# Altium schematic sheet Sheet4.SchDoc
size A4
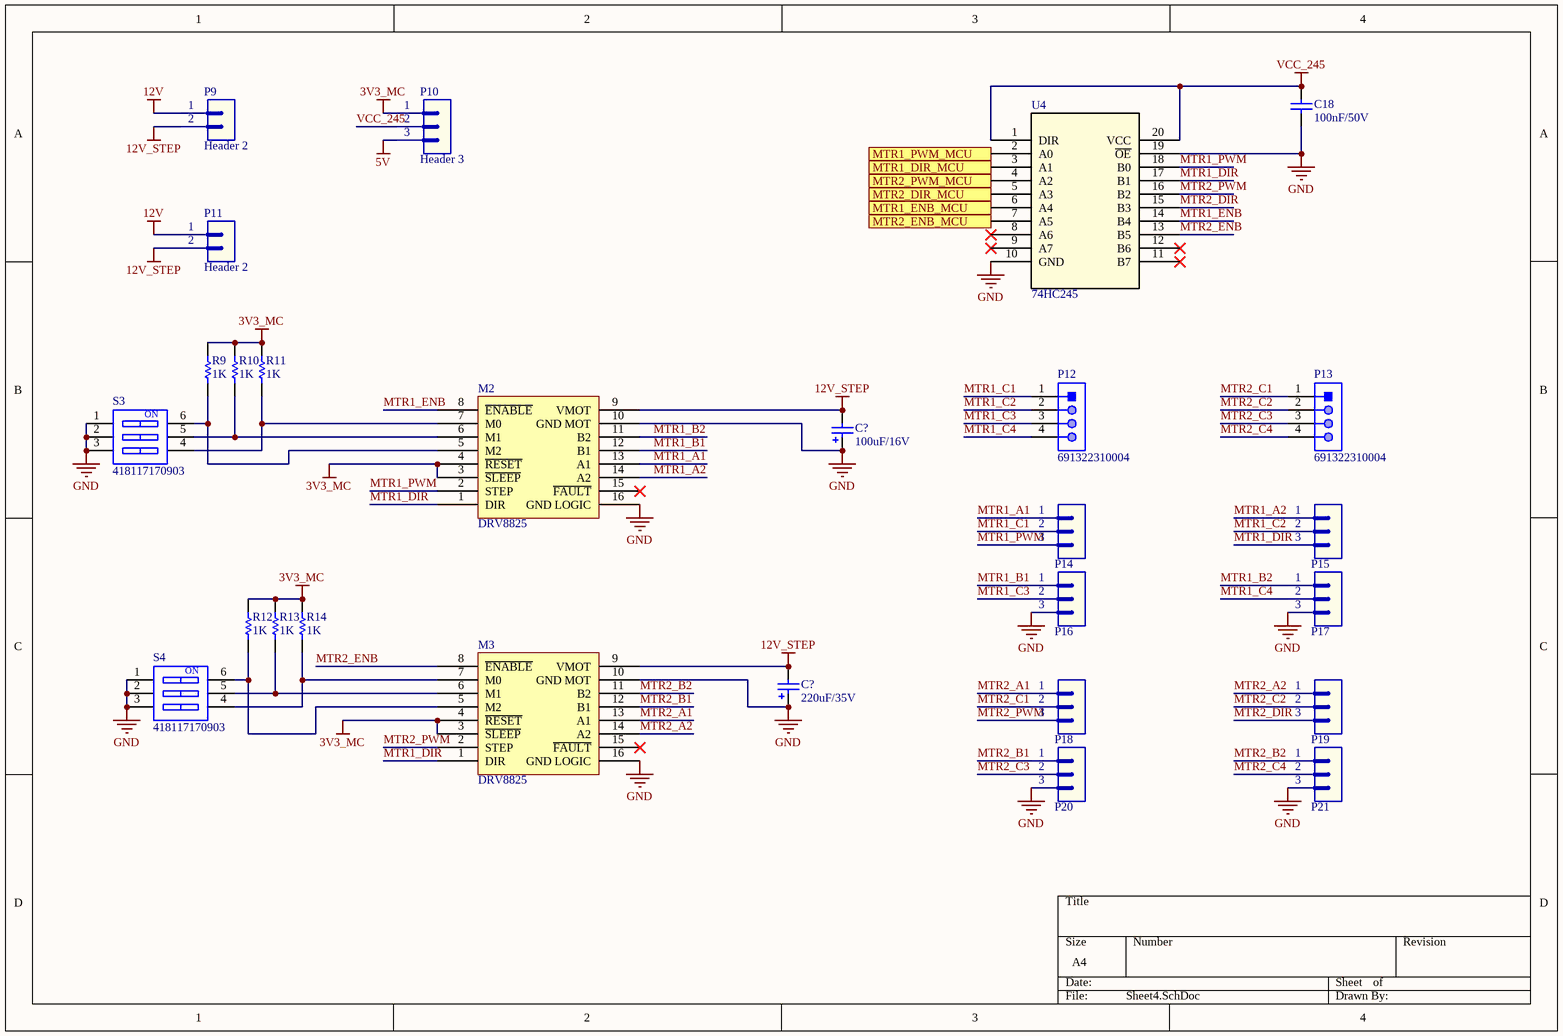
[diagram p0: Sheet4.SchDoc]

## Parts
(Parts that share a designator on the sheet are numbered #1, #2 ... from top to bottom, then left to right.)
C18  value 100nF/50V  [CAP-SM-0805]  (hidden comment: Cap-10uF-50V-0805)
C?#1  value 100uF/16V  [CAP-SM-AL-SIZE-D-D6L6]  (hidden comment: Cap-Al-100uF-16V-D6L5)
C?#2  value 220uF/35V  [CAP-SM-AL-SIZE-F-D8L10]  (hidden comment: Cap-Al-220uF-35V-D8L10)
M2  DRV8825  [DRV8825]
M3  DRV8825  [DRV8825]
P9  Header 2  [JP2]
P10  Header 3  [JP3]
P11  Header 2  [JP2]
P12  691322310004  [691322310004]
P13  691322310004  [691322310004]
P14  Header 3  [JP3]  (value not drawn)
P15  Header 3  [JP3]  (value not drawn)
P16  Header 3  [JP3]  (value not drawn)
P17  Header 3  [JP3]  (value not drawn)
P18  Header 3  [JP3]  (value not drawn)
P19  Header 3  [JP3]  (value not drawn)
P20  Header 3  [JP3]  (value not drawn)
P21  Header 3  [JP3]  (value not drawn)
R9  value 1K  [RES-SM-0805]  (hidden comment: Res-1K-0805)
R10  value 1K  [RES-SM-0805]  (hidden comment: Res-1K-0805)
R11  value 1K  [RES-SM-0805]  (hidden comment: Res-1K-0805)
R12  value 1K  [RES-SM-0805]  (hidden comment: Res-1K-0805)
R13  value 1K  [RES-SM-0805]  (hidden comment: Res-1K-0805)
R14  value 1K  [RES-SM-0805]  (hidden comment: Res-1K-0805)
S3  418117170903  [418117170903]
S4  418117170903  [418117170903]
U4  74HC245  [74HC245,625]

## Ports
MTR1_DIR_MCU (in), MTR1_ENB_MCU (in), MTR1_PWM_MCU (in), MTR2_DIR_MCU (in), MTR2_ENB_MCU (in), MTR2_PWM_MCU (in)

## Nets
3V3_MC: M2.3(~{SLEEP}) M2.4(~{RESET}) M3.3(~{SLEEP}) M3.4(~{RESET}) P10.1 R9.2 R10.2 R11.2 R12.2 R13.2 R14.2
5V: P10.3
12V: P9.1 P11.1
12V_STEP: C?#1.2 C?#2.2 M2.9(VMOT) M3.9(VMOT) P9.2 P11.2
GND: C18.1 C?#1.1 C?#2.1 M2.10(GND_MOT) M2.16(GND_LOGIC) M3.10(GND_MOT) M3.16(GND_LOGIC) P16.3 P17.3 P20.3 P21.3 S3.1 S3.2 S3.3 S4.1 S4.2 S4.3 U4.10(GND) U4.19(~{OE})
VCC_245: C18.2 P10.2 U4.1(DIR) U4.20(VCC)
MTR1_A1: M2.13(A1) P14.1
MTR1_A2: M2.14(A2) P15.1
MTR1_B1: M2.12(B1) P16.1
MTR1_B2: M2.11(B2) P17.1
MTR1_C1: P12.1 P14.2
MTR1_C2: P12.2 P15.2
MTR1_C3: P12.3 P16.2
MTR1_C4: P12.4 P17.2
MTR1_DIR: M2.1(DIR) M3.1(DIR) P15.3 U4.17(B1)
MTR1_DIR_MCU: U4.3(A1) ; port MTR1_DIR_MCU
MTR1_ENB: M2.8(~{ENABLE}) U4.14(B4)
MTR1_ENB_MCU: U4.6(A4) ; port MTR1_ENB_MCU
MTR1_PWM: M2.2(STEP) P14.3 U4.18(B0)
MTR1_PWM_MCU: U4.2(A0) ; port MTR1_PWM_MCU
MTR2_A1: M3.13(A1) P18.1
MTR2_A2: M3.14(A2) P19.1
MTR2_B1: M3.12(B1) P20.1
MTR2_B2: M3.11(B2) P21.1
MTR2_C1: P13.1 P18.2
MTR2_C2: P13.2 P19.2
MTR2_C3: P13.3 P20.2
MTR2_C4: P13.4 P21.2
MTR2_DIR: P19.3 U4.15(B3)
MTR2_DIR_MCU: U4.5(A3) ; port MTR2_DIR_MCU
MTR2_ENB: M3.8(~{ENABLE}) U4.13(B5)
MTR2_ENB_MCU: U4.7(A5) ; port MTR2_ENB_MCU
MTR2_PWM: M3.2(STEP) P18.3 U4.16(B2)
MTR2_PWM_MCU: U4.4(A2) ; port MTR2_PWM_MCU
NetM2_5: M2.5(M2) R9.1 S3.6
NetM2_6: M2.6(M1) R10.1 S3.5
NetM2_7: M2.7(M0) R11.1 S3.4
NetM3_5: M3.5(M2) R12.1 S4.6
NetM3_6: M3.6(M1) R13.1 S4.5
NetM3_7: M3.7(M0) R14.1 S4.4

Not connected (* = marked no-connect by the designer): M2 15(~{FAULT})*; M3 15(~{FAULT})*; U4 8(A6)* 9(A7)* 11(B7)* 12(B6)*

## Notes on the sheet
- (in symbol 418117170903) ON

## Library data of the parts
C18 = Cap-10uF-50V-0805: CAP CER 10UF 50V X5R 0805; Manufacturer: Yageo; Manufacturer Part Number: CC0805KKX5R9BB106; Local Supplier: thegioiic; Local Supplier Link: https://thegioiic.com/products/tu-10uf-50v-0805; Supplier 1: Digikey; Supplier 1 Link: https://www.digikey.com/product-detail/en/yageo/CC0805KKX5R9BB106/311-3499-2-ND/7164383; Supplier 1 Part Number: 311-3499-2-ND
C?#1 = Cap-Al-100uF-16V-D6L5: CAP ALUM 100UF 20% 16V SMD; Manufacturer: Nichicon; Manufacturer Part Number: UWX1C101MCL1GB; Local Supplier: thegioiic; Local Supplier Link: https://thegioiic.com/products/tu-nhom-smd-100uf-16v-d6-3l5-4; Supplier 1: Digikey; Supplier 1 Part Number: 493-2105-1-ND; Supplier 1 Link: https://www.digikey.com/product-detail/en/nichicon/UWX1C101MCL1GB/493-2105-1-ND/590080
C?#2 = Cap-Al-220uF-35V-D8L10: CAP ALUM 220UF 20% 35V SMD; Manufacturer: Nichicon; Manufacturer Part Number: UWT1V221MNL1GS; Local Supplier: thegioiic; Local Supplier Link: https://thegioiic.com/products/tu-nhom-smd-220uf-35v-d8l10; Supplier 1: Digikey; Supplier 1 Link: https://www.digikey.com/product-detail/en/nichicon/UWT1V221MNL1GS/493-2205-2-ND/589946; Supplier 1 Part Number: 493-2205-2-ND
P9 P11 = Header 2: Header, 2-Pin; LatestRevisionDate: 17-Jul-2002; LatestRevisionNote: Re-released for DXP Platform.; Publisher: Altium Limited
P10 P14-P21 = Header 3: Header, 3-Pin; LatestRevisionDate: 17-Jul-2002; LatestRevisionNote: Re-released for DXP Platform.; Publisher: Altium Limited
P12 P13 = 691322310004: WR-TBL Serie 322 Horizontal PCB Header, Pluggable, pitch 3.81mm, 4p; Compliance: RoHS; Modularity: No; Pin Number: 4; Rated Current [UL]: 10A; Working Voltage [UL]: 300VAC; ComponentLink1Description: Manufacturer; ComponentLink1URL: http://www.we-online.de; ComponentLink2URL: https://katalog.we-online.de/em/datasheet/691322310004.pdf; ComponentLink2Description: Datasheet; Mounting Technology: THT; Part Number: 691322310004; Packaging: Box; Operating Temperature: -40 to +105degC; PCB/Cable/Panel: PCB; Pitch: 3.81mm; Published Date: October 2019; Type: Horizontal; Publisher: Wurth Elektronik; Application: Pluggable
R9-R14 = Res-1K-0805: RES 1K OHM 1% 1/4W 0805; Manufacturer: Stackpole Electronics Inc; Manufacturer Part Number: RNCP0805FTD1K00; Local Supplier: thegioiic; Local Supplier Link: https://thegioiic.com/products/dien-tro-1k-ohm-0805-5; Supplier 1: Digikey; Supplier 1 Link: https://www.digikey.com/product-detail/en/stackpole-electronics-inc/RNCP0805FTD1K00/RNCP0805FTD1K00CT-ND/2240568; Supplier 1 Part Number: RNCP0805FTD1K00CT-ND
S3 S4 = 418117170903: WS-DITV Compact THT Dip Switch, Flat Actuator, pitch 2.54mm, 3p; Operation Force: 800g; Pole Number: 3; Actuator Type: Flat Type; Circuit: SPST-NO; Rated Current Switching: 25mA; Rated Current Non-Switching: 100mA; Rated Voltage Non-Switching: 50VDC; Rated Voltage Switching: 24VDC; ComponentLink1Description: Manufacturer; ComponentLink1URL: http://www.we-online.de; ComponentLink2Description: Datasheet; ComponentLink2URL: https://katalog.we-online.com/em/datasheet/418117170903.pdf; Pitch: 2.54mm; Contact Material: Copper Alloy; Mounting Technology: THT; Operating Temperature: -40 to +85degC; Contact Plating: Gold; Packaging: Tube; Part Number: 418117170903; Publisher: Wurth Elektronik; Published Date: September 2019
U4 = 74HC245: No Description Available; Vendor: Texas Instruments; Built_By: EMA_UL_Team; SourceLibrary: TI_2002-01-01_7; Manufacturer_Part_Number: 74HC245; Copyright: Copyright (C) 2018 Accelerated Designs. All rights reserved; RefDes: RefDes; Type: DEV